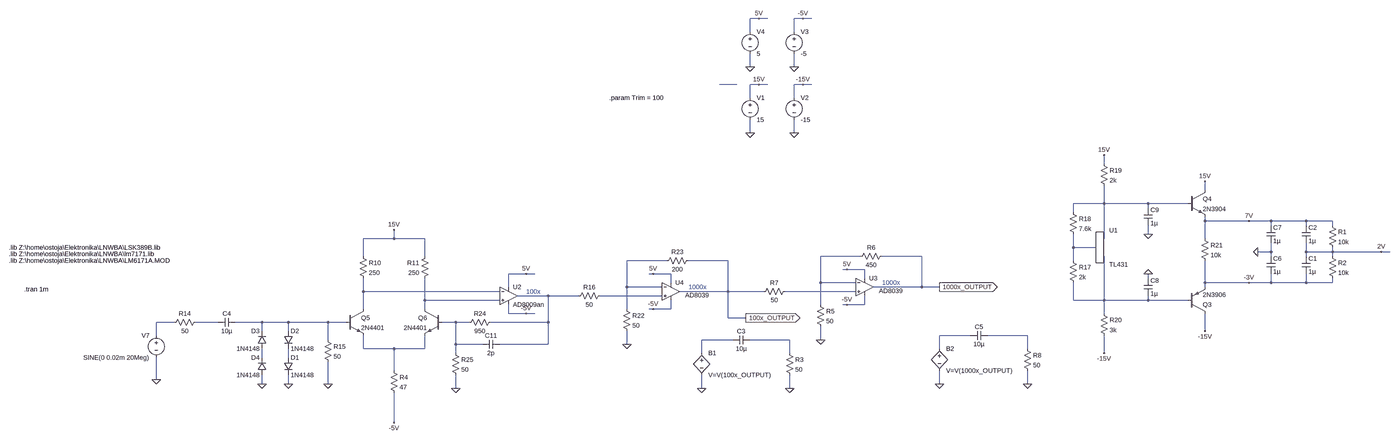
[diagram p0: schematic 001_centered_supply.asc, whole sheet]
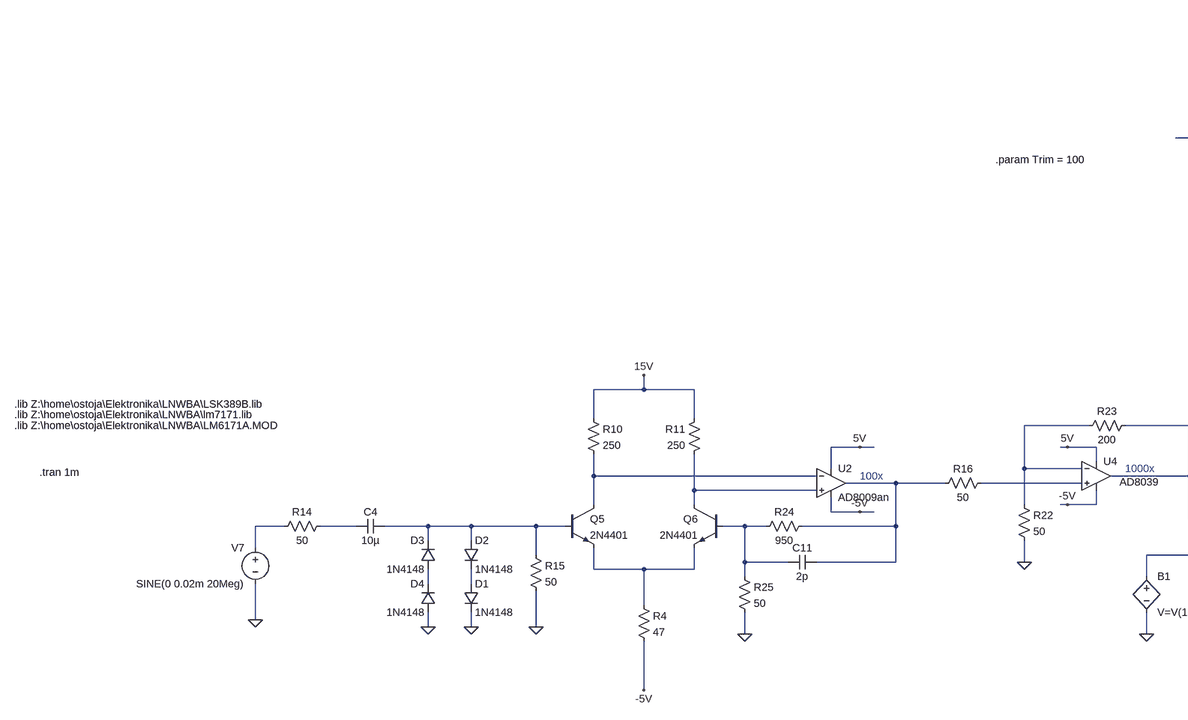
[diagram p1: schematic 001_centered_supply.asc, part, row 1 of 1, column 1 of 2]
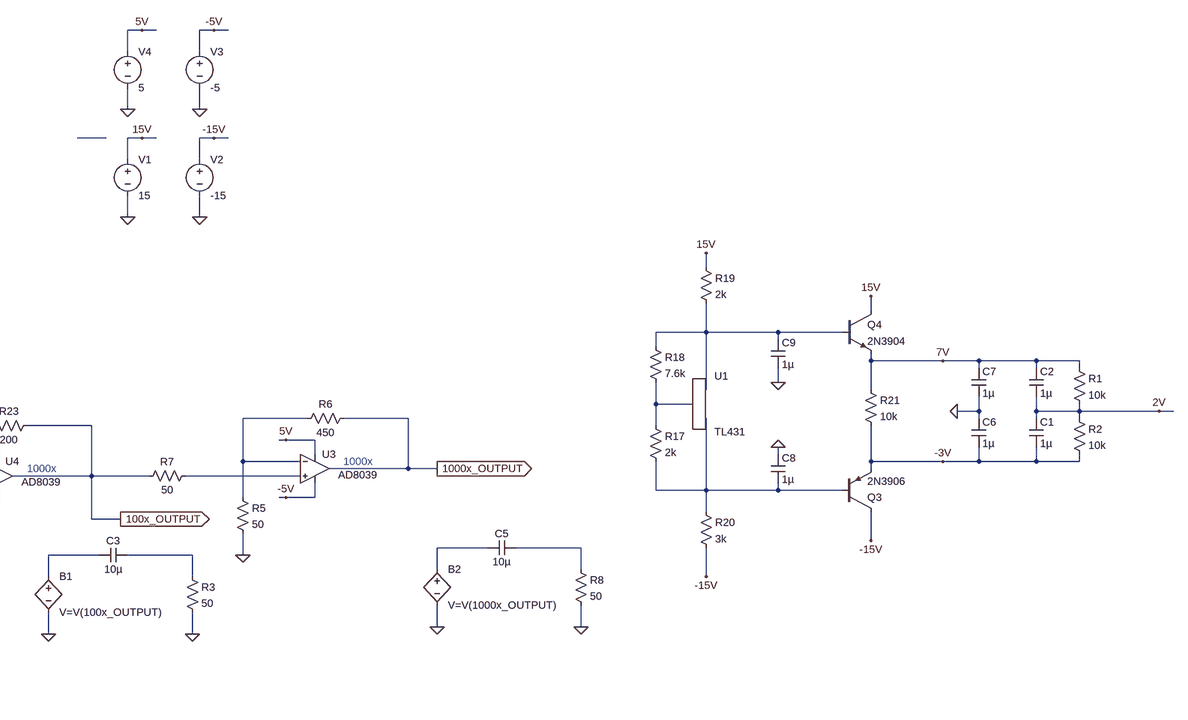
[diagram p2: schematic 001_centered_supply.asc, part, row 1 of 1, column 2 of 2]
001_centered_supply.asc, the LTspice schematic file:
Version 4
SHEET 1 3780 2884
WIRE 1104 -832 1072 -832
WIRE 1136 -832 1104 -832
WIRE 1264 -832 1232 -832
WIRE 1296 -832 1264 -832
WIRE 1072 -784 1072 -832
WIRE 1232 -784 1232 -832
WIRE 1072 -656 1072 -704
WIRE 1232 -656 1232 -704
WIRE 1024 -592 960 -592
WIRE 1104 -592 1072 -592
WIRE 1136 -592 1104 -592
WIRE 1264 -592 1232 -592
WIRE 1296 -592 1264 -592
WIRE 1072 -544 1072 -592
WIRE 1232 -544 1232 -592
WIRE 1072 -416 1072 -464
WIRE 1232 -416 1232 -464
WIRE 2720 -304 2720 -336
WIRE 3088 -208 3088 -240
WIRE 2720 -160 2720 -224
WIRE 2720 -160 2608 -160
WIRE 2880 -160 2720 -160
WIRE 3024 -160 2880 -160
WIRE 2880 -144 2880 -160
WIRE 2608 -128 2608 -160
WIRE 3088 -96 3088 -112
WIRE 3248 -96 3088 -96
WIRE 3328 -96 3248 -96
WIRE 3456 -96 3328 -96
WIRE 3552 -96 3456 -96
WIRE 3328 -80 3328 -96
WIRE 3456 -80 3456 -96
WIRE 3552 -80 3552 -96
WIRE 2880 -48 2880 -80
WIRE -240 -32 -240 -64
WIRE -240 -32 -352 -32
WIRE -128 -32 -240 -32
WIRE 2720 -32 2720 -160
WIRE 3088 -32 3088 -96
WIRE 2608 0 2608 -48
WIRE 2688 0 2608 0
WIRE 3328 16 3328 -16
WIRE 3328 16 3280 16
WIRE 3456 16 3456 -16
WIRE 3552 16 3552 0
WIRE 3552 16 3456 16
WIRE 3744 16 3552 16
WIRE 3776 16 3744 16
WIRE -352 32 -352 -32
WIRE -128 32 -128 -32
WIRE 1472 32 1328 32
WIRE 1696 32 1552 32
WIRE 3328 32 3328 16
WIRE 3456 32 3456 16
WIRE 3552 32 3552 16
WIRE 768 48 624 48
WIRE 992 48 848 48
WIRE 2608 48 2608 0
WIRE 1424 80 1408 80
WIRE 1488 80 1424 80
WIRE 240 96 176 96
WIRE 272 96 240 96
WIRE 720 96 704 96
WIRE 784 96 720 96
WIRE 1488 112 1488 80
WIRE 2880 112 2880 96
WIRE 784 128 784 96
WIRE 1328 128 1328 32
WIRE 1456 128 1328 128
WIRE 3088 128 3088 48
WIRE 3248 128 3088 128
WIRE 3328 128 3328 96
WIRE 3328 128 3248 128
WIRE 3456 128 3456 96
WIRE 3456 128 3328 128
WIRE 3552 128 3552 112
WIRE 3552 128 3456 128
WIRE 176 144 176 96
WIRE 624 144 624 48
WIRE 752 144 624 144
WIRE 1696 144 1696 32
WIRE 1696 144 1520 144
WIRE 1760 144 1696 144
WIRE 3088 144 3088 128
WIRE -352 160 -352 112
WIRE 144 160 -352 160
WIRE 992 160 992 48
WIRE 992 160 816 160
WIRE 1120 160 992 160
WIRE 1456 160 1200 160
WIRE 320 176 208 176
WIRE 448 176 320 176
WIRE 752 176 528 176
WIRE -128 192 -128 112
WIRE 144 192 -128 192
WIRE 2608 192 2608 128
WIRE 2720 192 2720 32
WIRE 2720 192 2608 192
WIRE 2880 192 2880 176
WIRE 2880 192 2720 192
WIRE 3024 192 2880 192
WIRE 1328 208 1328 128
WIRE 1424 208 1408 208
WIRE 1488 208 1488 176
WIRE 1488 208 1424 208
WIRE -352 224 -352 160
WIRE -128 224 -128 192
WIRE 624 224 624 144
WIRE 720 224 704 224
WIRE 784 224 784 192
WIRE 784 224 720 224
WIRE 176 240 176 208
WIRE 240 240 176 240
WIRE 272 240 240 240
WIRE 2720 240 2720 192
WIRE 992 256 992 160
WIRE 1056 256 992 256
WIRE -1040 272 -1104 272
WIRE -880 272 -960 272
WIRE -720 272 -816 272
WIRE -624 272 -720 272
WIRE -480 272 -624 272
WIRE -416 272 -480 272
WIRE -16 272 -64 272
WIRE 32 272 -16 272
WIRE 320 272 320 176
WIRE 320 272 112 272
WIRE -720 304 -720 272
WIRE -624 304 -624 272
WIRE 3088 304 3088 240
WIRE -1104 320 -1104 272
WIRE 1872 320 1760 320
WIRE 2080 320 1936 320
WIRE -480 336 -480 272
WIRE 1008 336 896 336
WIRE 1216 336 1072 336
WIRE 1328 336 1328 288
WIRE -16 352 -16 272
WIRE 80 352 -16 352
WIRE 320 352 320 272
WIRE 320 352 144 352
WIRE 624 352 624 304
WIRE -352 368 -352 320
WIRE -240 368 -352 368
WIRE -128 368 -128 320
WIRE -128 368 -240 368
WIRE 1760 368 1760 320
WIRE 2080 368 2080 320
WIRE -16 384 -16 352
WIRE 896 384 896 336
WIRE 1216 384 1216 336
WIRE 2720 384 2720 320
WIRE -720 400 -720 368
WIRE -624 400 -624 368
WIRE -240 448 -240 368
WIRE -1104 480 -1104 400
WIRE -720 496 -720 464
WIRE -624 496 -624 464
WIRE -480 496 -480 416
WIRE 1760 496 1760 448
WIRE 2080 496 2080 448
WIRE -16 512 -16 464
WIRE 896 512 896 464
WIRE 1216 512 1216 464
WIRE -240 640 -240 528
FLAG 1104 -592 15V
FLAG 1264 -592 -15V
FLAG 1232 -416 0
FLAG 1072 -416 0
FLAG -240 -64 15V
FLAG -240 640 -5V
FLAG -480 496 0
FLAG 2720 -336 15V
FLAG 2720 384 -15V
FLAG 3088 304 -15V
FLAG 3088 -240 15V
FLAG 3248 -96 7V
FLAG 3248 128 -3V
FLAG 3280 16 0
FLAG 2880 96 0
FLAG 2880 -48 0
FLAG 3744 16 2V
FLAG 1104 -832 5V
FLAG 1264 -832 -5V
FLAG 1232 -656 0
FLAG 1072 -656 0
FLAG 240 96 5V
FLAG 240 240 -5V
FLAG 720 224 -5V
FLAG 720 96 5V
FLAG 624 352 0
FLAG 1424 208 -5V
FLAG 1424 80 5V
FLAG 1328 336 0
FLAG -1104 480 0
FLAG -624 496 0
FLAG -720 496 0
FLAG -16 512 0
FLAG 1056 256 100x_OUTPUT
IOPIN 1056 256 Out
FLAG 1760 144 1000x_OUTPUT
IOPIN 1760 144 Out
FLAG 896 512 0
FLAG 1216 512 0
FLAG 1760 496 0
FLAG 2080 496 0
SYMBOL voltage 1072 -560 R0
WINDOW 123 0 0 Left 0
WINDOW 39 0 0 Left 0
SYMATTR InstName V1
SYMATTR Value 15
SYMBOL voltage 1232 -560 R0
WINDOW 123 0 0 Left 0
WINDOW 39 0 0 Left 0
SYMATTR InstName V2
SYMATTR Value -15
SYMBOL voltage -1104 304 M0
WINDOW 123 0 0 Left 0
WINDOW 39 0 0 Left 0
SYMATTR InstName V7
SYMATTR Value SINE(0 0.02m 20Meg)
SYMBOL res -368 16 R0
SYMATTR InstName R10
SYMATTR Value 250
SYMBOL res -112 16 M0
SYMATTR InstName R11
SYMATTR Value 250
SYMBOL cap -816 256 R90
WINDOW 0 0 32 VBottom 2
WINDOW 3 32 32 VTop 2
SYMATTR InstName C4
SYMATTR Value 10µ
SYMBOL res -944 256 R90
WINDOW 0 0 56 VBottom 2
WINDOW 3 32 56 VTop 2
SYMATTR InstName R14
SYMATTR Value 50
SYMBOL res -496 320 R0
SYMATTR InstName R15
SYMATTR Value 50
SYMBOL res 544 160 R90
WINDOW 0 0 56 VBottom 2
WINDOW 3 32 56 VTop 2
SYMATTR InstName R16
SYMATTR Value 50
SYMBOL ZZZ\\REF\\TL431 2704 -32 R0
SYMATTR InstName U1
SYMBOL res 2592 32 R0
SYMATTR InstName R17
SYMATTR Value 2k
SYMBOL res 2592 -144 R0
SYMATTR InstName R18
SYMATTR Value 7.6k
SYMBOL res 2704 -320 R0
SYMATTR InstName R19
SYMATTR Value 2k
SYMBOL res 2704 224 R0
SYMATTR InstName R20
SYMATTR Value 3k
SYMBOL pnp 3024 240 M180
SYMATTR InstName Q3
SYMATTR Value 2N3906
SYMBOL res 3072 -48 R0
SYMATTR InstName R21
SYMATTR Value 10k
SYMBOL npn 3024 -208 R0
SYMATTR InstName Q4
SYMATTR Value 2N3904
SYMBOL cap 3312 32 R0
SYMATTR InstName C6
SYMATTR Value 1µ
SYMBOL cap 3312 -80 R0
SYMATTR InstName C7
SYMATTR Value 1µ
SYMBOL cap 2864 112 R0
SYMATTR InstName C8
SYMATTR Value 1µ
SYMBOL cap 2864 -144 R0
SYMATTR InstName C9
SYMATTR Value 1µ
SYMBOL OpAmps\\AD8039 784 96 R0
WINDOW 3 52 78 Left 2
SYMATTR InstName U4
SYMBOL res 608 208 R0
SYMATTR InstName R22
SYMATTR Value 50
SYMBOL res 864 32 R90
WINDOW 0 0 56 VBottom 2
WINDOW 3 32 56 VTop 2
SYMATTR InstName R23
SYMATTR Value 200
SYMBOL res 128 256 R90
WINDOW 0 0 56 VBottom 2
WINDOW 3 32 56 VTop 2
SYMATTR InstName R24
SYMATTR Value 950
SYMBOL res -32 368 R0
SYMATTR InstName R25
SYMATTR Value 50
SYMBOL cap 144 336 R90
WINDOW 0 0 32 VBottom 2
WINDOW 3 32 32 VTop 2
SYMATTR InstName C11
SYMATTR Value 2p
SYMBOL npn -416 224 R0
SYMATTR InstName Q5
SYMATTR Value 2N4401
SYMBOL npn -64 224 M0
SYMATTR InstName Q6
SYMATTR Value 2N4401
SYMBOL cap 3440 32 R0
SYMATTR InstName C1
SYMATTR Value 1µ
SYMBOL cap 3440 -80 R0
SYMATTR InstName C2
SYMATTR Value 1µ
SYMBOL res 3536 -96 R0
SYMATTR InstName R1
SYMATTR Value 10k
SYMBOL res 3536 16 R0
SYMATTR InstName R2
SYMATTR Value 10k
SYMBOL ZZZ\\OpAmp\\AD8009an 176 176 R0
SYMATTR InstName U2
SYMBOL voltage 1232 -800 R0
WINDOW 123 0 0 Left 0
WINDOW 39 0 0 Left 0
SYMATTR InstName V3
SYMATTR Value -5
SYMBOL voltage 1072 -800 R0
WINDOW 123 0 0 Left 0
WINDOW 39 0 0 Left 0
SYMATTR InstName V4
SYMATTR Value 5
SYMBOL res -256 432 R0
SYMATTR InstName R4
SYMATTR Value 47
SYMBOL OpAmps\\AD8039 1488 80 R0
WINDOW 3 52 78 Left 2
SYMATTR InstName U3
SYMBOL res 1312 192 R0
SYMATTR InstName R5
SYMATTR Value 50
SYMBOL res 1568 16 R90
WINDOW 0 0 56 VBottom 2
WINDOW 3 32 56 VTop 2
SYMATTR InstName R6
SYMATTR Value 450
SYMBOL res 1216 144 R90
WINDOW 0 0 56 VBottom 2
WINDOW 3 32 56 VTop 2
SYMATTR InstName R7
SYMATTR Value 50
SYMBOL diode -640 400 R0
SYMATTR InstName D1
SYMATTR Value 1N4148
SYMBOL diode -640 304 R0
SYMATTR InstName D2
SYMATTR Value 1N4148
SYMBOL diode -704 368 R180
WINDOW 0 24 64 Left 2
WINDOW 3 24 0 Left 2
SYMATTR InstName D3
SYMATTR Value 1N4148
SYMBOL diode -704 464 R180
WINDOW 0 24 64 Left 2
WINDOW 3 24 0 Left 2
SYMATTR InstName D4
SYMATTR Value 1N4148
SYMBOL bv 896 368 R0
SYMATTR InstName B1
SYMATTR Value V=V(100x_OUTPUT)
SYMBOL bv 1760 352 R0
SYMATTR InstName B2
SYMATTR Value V=V(1000x_OUTPUT)
SYMBOL cap 1072 320 R90
WINDOW 0 0 32 VBottom 2
WINDOW 3 32 32 VTop 2
SYMATTR InstName C3
SYMATTR Value 10µ
SYMBOL res 1200 368 R0
SYMATTR InstName R3
SYMATTR Value 50
SYMBOL cap 1936 304 R90
WINDOW 0 0 32 VBottom 2
WINDOW 3 32 32 VTop 2
SYMATTR InstName C5
SYMATTR Value 10µ
SYMBOL res 2064 352 R0
SYMATTR InstName R8
SYMATTR Value 50
TEXT -1640 0 Left 2 !.lib Z:\\home\\ostoja\\Elektronika\\LNWBA\\LSK389B.lib
TEXT -1584 152 Left 2 !.tran 1m
TEXT -1640 24 Left 2 !.lib Z:\\home\\ostoja\\Elektronika\\LNWBA\\lm7171.lib
TEXT -1640 48 Left 2 !.lib Z:\\home\\ostoja\\Elektronika\\LNWBA\\LM6171A.MOD
TEXT 560 -544 Left 2 !.param Trim = 100
TEXT 240 160 Left 2 ;100x
TEXT 848 144 Left 2 ;1000x
TEXT 1552 128 Left 2 ;1000x

The netlist it stands for:
* 001_centered_supply.asc
V1 15V 0 15
V2 -15V 0 -15
V7 N012 0 SINE(0 0.02m 20Meg)
R10 15V N006 250
R11 15V N010 250
C4 N014 N013 10µ
R14 N013 N012 50
R15 N014 0 50
R16 N009 N008 50
XU1 N003 N011 N002 TL431
R17 N003 N011 2k
R18 N002 N003 7.6k
R19 15V N002 2k
R20 N011 -15V 3k
Q3 -15V N011 -3V 0 2N3906
R21 7V -3V 10k
Q4 15V N002 7V 0 2N3904
C6 0 -3V 1µ
C7 7V 0 1µ
C8 0 N011 1µ
C9 N002 0 1µ
XU4 N009 N005 5V -5V 100x_OUTPUT AD8039  ; pins In+ In- V+ V- OUT
R22 N005 0 50
R23 100x_OUTPUT N005 200
R24 N008 N015 950
R25 N015 0 50
C11 N008 N015 2p
Q5 N006 N014 N020 0 2N4401
Q6 N010 N015 N020 0 2N4401
C1 2V -3V 1µ
C2 7V 2V 1µ
R1 7V 2V 10k
R2 2V -3V 10k
* U2: AD8009an (symbol ZZZ\OpAmp\AD8009an not available, pins judged from their places): In+=N010 In-=N006 V+=5V V-=-5V OUT=N008
V3 -5V 0 -5
V4 5V 0 5
R4 N020 -5V 47
XU3 N007 N004 5V -5V 1000x_OUTPUT AD8039  ; pins In+ In- V+ V- OUT
R5 N004 0 50
R6 1000x_OUTPUT N004 450
R7 N007 100x_OUTPUT 50
D1 N022 0 1N4148
D2 N014 N022 1N4148
D3 N021 N014 1N4148
D4 0 N021 1N4148
B1 N018 0 V=V(100x_OUTPUT)
B2 N016 0 V=V(1000x_OUTPUT)
C3 N019 N018 10µ
R3 N019 0 50
C5 N017 N016 10µ
R8 N017 0 50
.model D D
.lib standard.dio
.model NPN NPN
.model PNP PNP
.lib standard.bjt
.lib Z:\home\ostoja\Elektronika\LNWBA\LSK389B.lib
.tran 1m
.lib Z:\home\ostoja\Elektronika\LNWBA\lm7171.lib
.lib Z:\home\ostoja\Elektronika\LNWBA\LM6171A.MOD
.param Trim = 100
* 100x
* 1000x
* 1000x
.lib TL431.mod
.backanno
.end